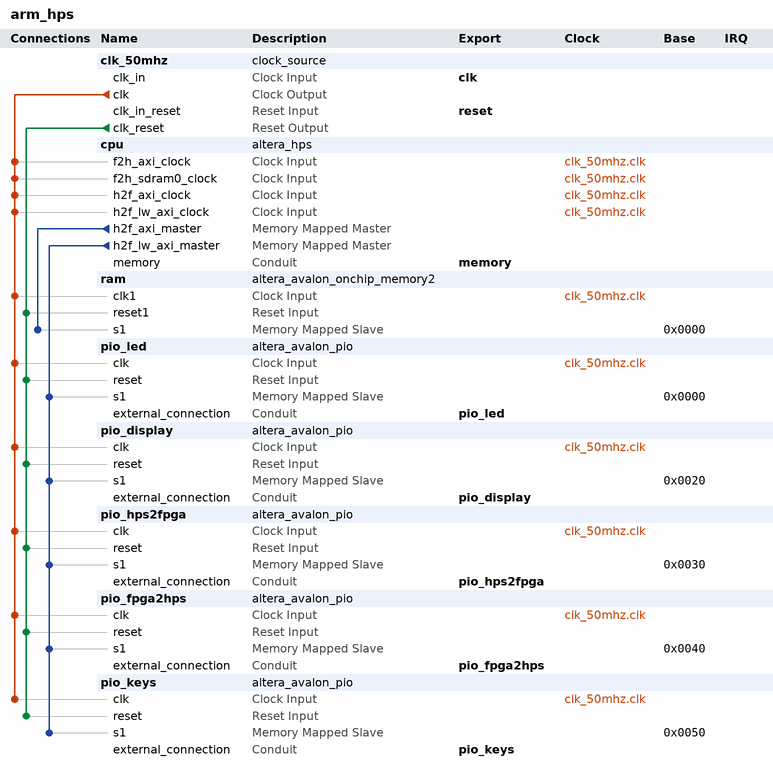
[diagram p0: system contents]
# Platform Designer (Qsys) system arm_hps, Cyclone V 5CSEMA5F31C6
# Parameters at their usual value, and those the tool derives, are not listed.
package require -exact qsys 16.1
create_system arm_hps
set_project_property DEVICE_FAMILY {Cyclone V}
set_project_property DEVICE 5CSEMA5F31C6

add_instance clk_50mhz clock_source 16.1
set_instance_parameter_value clk_50mhz clockFrequency 50000000

add_instance cpu altera_hps 16.1
set_instance_parameter_value cpu EMAC1_Mode N/A
set_instance_parameter_value cpu EMAC1_PinMuxing Unused
set_instance_parameter_value cpu F2SCLK_COLDRST_Enable false
set_instance_parameter_value cpu F2SCLK_DBGRST_Enable false
set_instance_parameter_value cpu F2SCLK_WARMRST_Enable false
set_instance_parameter_value cpu F2SDRAM_Type AXI-3
set_instance_parameter_value cpu F2SDRAM_Width 64
set_instance_parameter_value cpu F2SINTERRUPT_Enable false
set_instance_parameter_value cpu F2S_Width 1
set_instance_parameter_value cpu FPGA_PERIPHERAL_OUTPUT_CLOCK_FREQ_EMAC0_GTX_CLK 125
set_instance_parameter_value cpu FPGA_PERIPHERAL_OUTPUT_CLOCK_FREQ_EMAC0_MD_CLK 2.5
set_instance_parameter_value cpu FPGA_PERIPHERAL_OUTPUT_CLOCK_FREQ_EMAC1_GTX_CLK 125
set_instance_parameter_value cpu FPGA_PERIPHERAL_OUTPUT_CLOCK_FREQ_EMAC1_MD_CLK 2.5
set_instance_parameter_value cpu HPS_PROTOCOL DDR3
set_instance_parameter_value cpu I2C0_Mode N/A
set_instance_parameter_value cpu I2C0_PinMuxing Unused
set_instance_parameter_value cpu I2C1_Mode N/A
set_instance_parameter_value cpu I2C1_PinMuxing Unused
set_instance_parameter_value cpu LWH2F_Enable true
set_instance_parameter_value cpu MEM_BANKADDR_WIDTH 3
set_instance_parameter_value cpu MEM_CLK_FREQ 300.0
set_instance_parameter_value cpu MEM_CLK_FREQ_MAX 400.0
set_instance_parameter_value cpu MEM_COL_ADDR_WIDTH 8
set_instance_parameter_value cpu MEM_DQ_WIDTH 8
set_instance_parameter_value cpu MEM_DRV_STR RZQ/6
set_instance_parameter_value cpu MEM_ROW_ADDR_WIDTH 12
set_instance_parameter_value cpu MEM_RTT_NOM {ODT Disabled}
set_instance_parameter_value cpu MEM_RTT_WR {Dynamic ODT off}
set_instance_parameter_value cpu MEM_TCL 7
set_instance_parameter_value cpu MEM_TFAW_NS 37.5
set_instance_parameter_value cpu MEM_TINIT_US 499
set_instance_parameter_value cpu MEM_TMRD_CK 3
set_instance_parameter_value cpu MEM_TRAS_NS 40.0
set_instance_parameter_value cpu MEM_TRCD_NS 15.0
set_instance_parameter_value cpu MEM_TREFI_US 7.0
set_instance_parameter_value cpu MEM_TRFC_NS 75.0
set_instance_parameter_value cpu MEM_TRP_NS 15.0
set_instance_parameter_value cpu MEM_TWTR 2
set_instance_parameter_value cpu MEM_VENDOR JEDEC
set_instance_parameter_value cpu MEM_WTCL 6
set_instance_parameter_value cpu QSPI_Mode N/A
set_instance_parameter_value cpu QSPI_PinMuxing Unused
set_instance_parameter_value cpu REF_CLK_FREQ 125.0
set_instance_parameter_value cpu S2FCLK_USER2CLK 5
set_instance_parameter_value cpu S2F_Width 1
set_instance_parameter_value cpu SDIO_Mode N/A
set_instance_parameter_value cpu SDIO_PinMuxing Unused
set_instance_parameter_value cpu SPIM1_Mode N/A
set_instance_parameter_value cpu SPIM1_PinMuxing Unused
set_instance_parameter_value cpu STM_Enable false
set_instance_parameter_value cpu TIMING_BOARD_AC_SKEW 0.02
set_instance_parameter_value cpu TIMING_BOARD_AC_TO_CK_SKEW 0.0
set_instance_parameter_value cpu TIMING_BOARD_DQ_TO_DQS_SKEW 0.0
set_instance_parameter_value cpu TIMING_BOARD_MAX_CK_DELAY 0.6
set_instance_parameter_value cpu TIMING_BOARD_MAX_DQS_DELAY 0.6
set_instance_parameter_value cpu TIMING_BOARD_SKEW_BETWEEN_DQS 0.02
set_instance_parameter_value cpu TIMING_BOARD_SKEW_CKDQS_DIMM_MAX 0.01
set_instance_parameter_value cpu TIMING_BOARD_SKEW_CKDQS_DIMM_MIN -0.01
set_instance_parameter_value cpu TIMING_BOARD_SKEW_WITHIN_DQS 0.02
set_instance_parameter_value cpu TIMING_TDH 125
set_instance_parameter_value cpu TIMING_TDQSCK 400
set_instance_parameter_value cpu TIMING_TDQSQ 120
set_instance_parameter_value cpu TIMING_TDS 50
set_instance_parameter_value cpu TIMING_TIH 250
set_instance_parameter_value cpu TIMING_TIS 175
set_instance_parameter_value cpu TIMING_TQSH 0.38
set_instance_parameter_value cpu UART0_Mode N/A
set_instance_parameter_value cpu UART0_PinMuxing Unused
set_instance_parameter_value cpu USB1_Mode N/A
set_instance_parameter_value cpu USB1_PinMuxing Unused
set_instance_parameter_value cpu desired_cfg_clk_mhz 100.0
set_instance_parameter_value cpu desired_qspi_clk_mhz 400.0

add_instance ram altera_avalon_onchip_memory2 16.1
set_instance_parameter_value ram dataWidth 32
set_instance_parameter_value ram dualPort false
set_instance_parameter_value ram initMemContent true
set_instance_parameter_value ram initializationFileName onchip_mem.hex
set_instance_parameter_value ram memorySize 4096

add_instance pio_led altera_avalon_pio 16.1
set_instance_parameter_value pio_led direction Output
set_instance_parameter_value pio_led width 10

add_instance pio_display altera_avalon_pio 16.1
set_instance_parameter_value pio_display direction Output
set_instance_parameter_value pio_display width 32

add_instance pio_hps2fpga altera_avalon_pio 16.1
set_instance_parameter_value pio_hps2fpga direction Output
set_instance_parameter_value pio_hps2fpga width 16

add_instance pio_fpga2hps altera_avalon_pio 16.1
set_instance_parameter_value pio_fpga2hps direction Input
set_instance_parameter_value pio_fpga2hps width 16

add_instance pio_keys altera_avalon_pio 16.1
set_instance_parameter_value pio_keys captureEdge true
set_instance_parameter_value pio_keys direction Input
set_instance_parameter_value pio_keys width 4

# connections
add_connection clk_50mhz.clk cpu.f2h_axi_clock clock
add_connection clk_50mhz.clk cpu.f2h_sdram0_clock clock
add_connection clk_50mhz.clk cpu.h2f_axi_clock clock
add_connection clk_50mhz.clk cpu.h2f_lw_axi_clock clock
add_connection clk_50mhz.clk pio_display.clk clock
add_connection clk_50mhz.clk pio_fpga2hps.clk clock
add_connection clk_50mhz.clk pio_hps2fpga.clk clock
add_connection clk_50mhz.clk pio_keys.clk clock
add_connection clk_50mhz.clk pio_led.clk clock
add_connection clk_50mhz.clk ram.clk1 clock
add_connection clk_50mhz.clk_reset pio_display.reset reset
add_connection clk_50mhz.clk_reset pio_fpga2hps.reset reset
add_connection clk_50mhz.clk_reset pio_hps2fpga.reset reset
add_connection clk_50mhz.clk_reset pio_keys.reset reset
add_connection clk_50mhz.clk_reset pio_led.reset reset
add_connection clk_50mhz.clk_reset ram.reset1 reset
add_connection cpu.h2f_axi_master ram.s1 avalon
set_connection_parameter_value cpu.h2f_axi_master/ram.s1 baseAddress 0x0000
add_connection cpu.h2f_lw_axi_master pio_display.s1 avalon
set_connection_parameter_value cpu.h2f_lw_axi_master/pio_display.s1 baseAddress 0x0020
add_connection cpu.h2f_lw_axi_master pio_fpga2hps.s1 avalon
set_connection_parameter_value cpu.h2f_lw_axi_master/pio_fpga2hps.s1 baseAddress 0x0040
add_connection cpu.h2f_lw_axi_master pio_hps2fpga.s1 avalon
set_connection_parameter_value cpu.h2f_lw_axi_master/pio_hps2fpga.s1 baseAddress 0x0030
add_connection cpu.h2f_lw_axi_master pio_keys.s1 avalon
set_connection_parameter_value cpu.h2f_lw_axi_master/pio_keys.s1 baseAddress 0x0050
add_connection cpu.h2f_lw_axi_master pio_led.s1 avalon
set_connection_parameter_value cpu.h2f_lw_axi_master/pio_led.s1 baseAddress 0x0000

# exported interfaces
add_interface clk clock sink
set_interface_property clk EXPORT_OF clk_50mhz.clk_in
add_interface memory conduit end
set_interface_property memory EXPORT_OF cpu.memory
add_interface pio_display conduit end
set_interface_property pio_display EXPORT_OF pio_display.external_connection
add_interface pio_fpga2hps conduit end
set_interface_property pio_fpga2hps EXPORT_OF pio_fpga2hps.external_connection
add_interface pio_hps2fpga conduit end
set_interface_property pio_hps2fpga EXPORT_OF pio_hps2fpga.external_connection
add_interface pio_keys conduit end
set_interface_property pio_keys EXPORT_OF pio_keys.external_connection
add_interface pio_led conduit end
set_interface_property pio_led EXPORT_OF pio_led.external_connection
add_interface reset reset sink
set_interface_property reset EXPORT_OF clk_50mhz.clk_in_reset

set_interconnect_requirement {$system} qsys_mm.clockCrossingAdapter HANDSHAKE
set_interconnect_requirement {$system} qsys_mm.enableEccProtection FALSE
set_interconnect_requirement {$system} qsys_mm.insertDefaultSlave FALSE
set_interconnect_requirement {$system} qsys_mm.maxAdditionalLatency 1

save_system arm_hps.qsys
